# EAGLE design uCBoard (EAGLE 7.5.0)
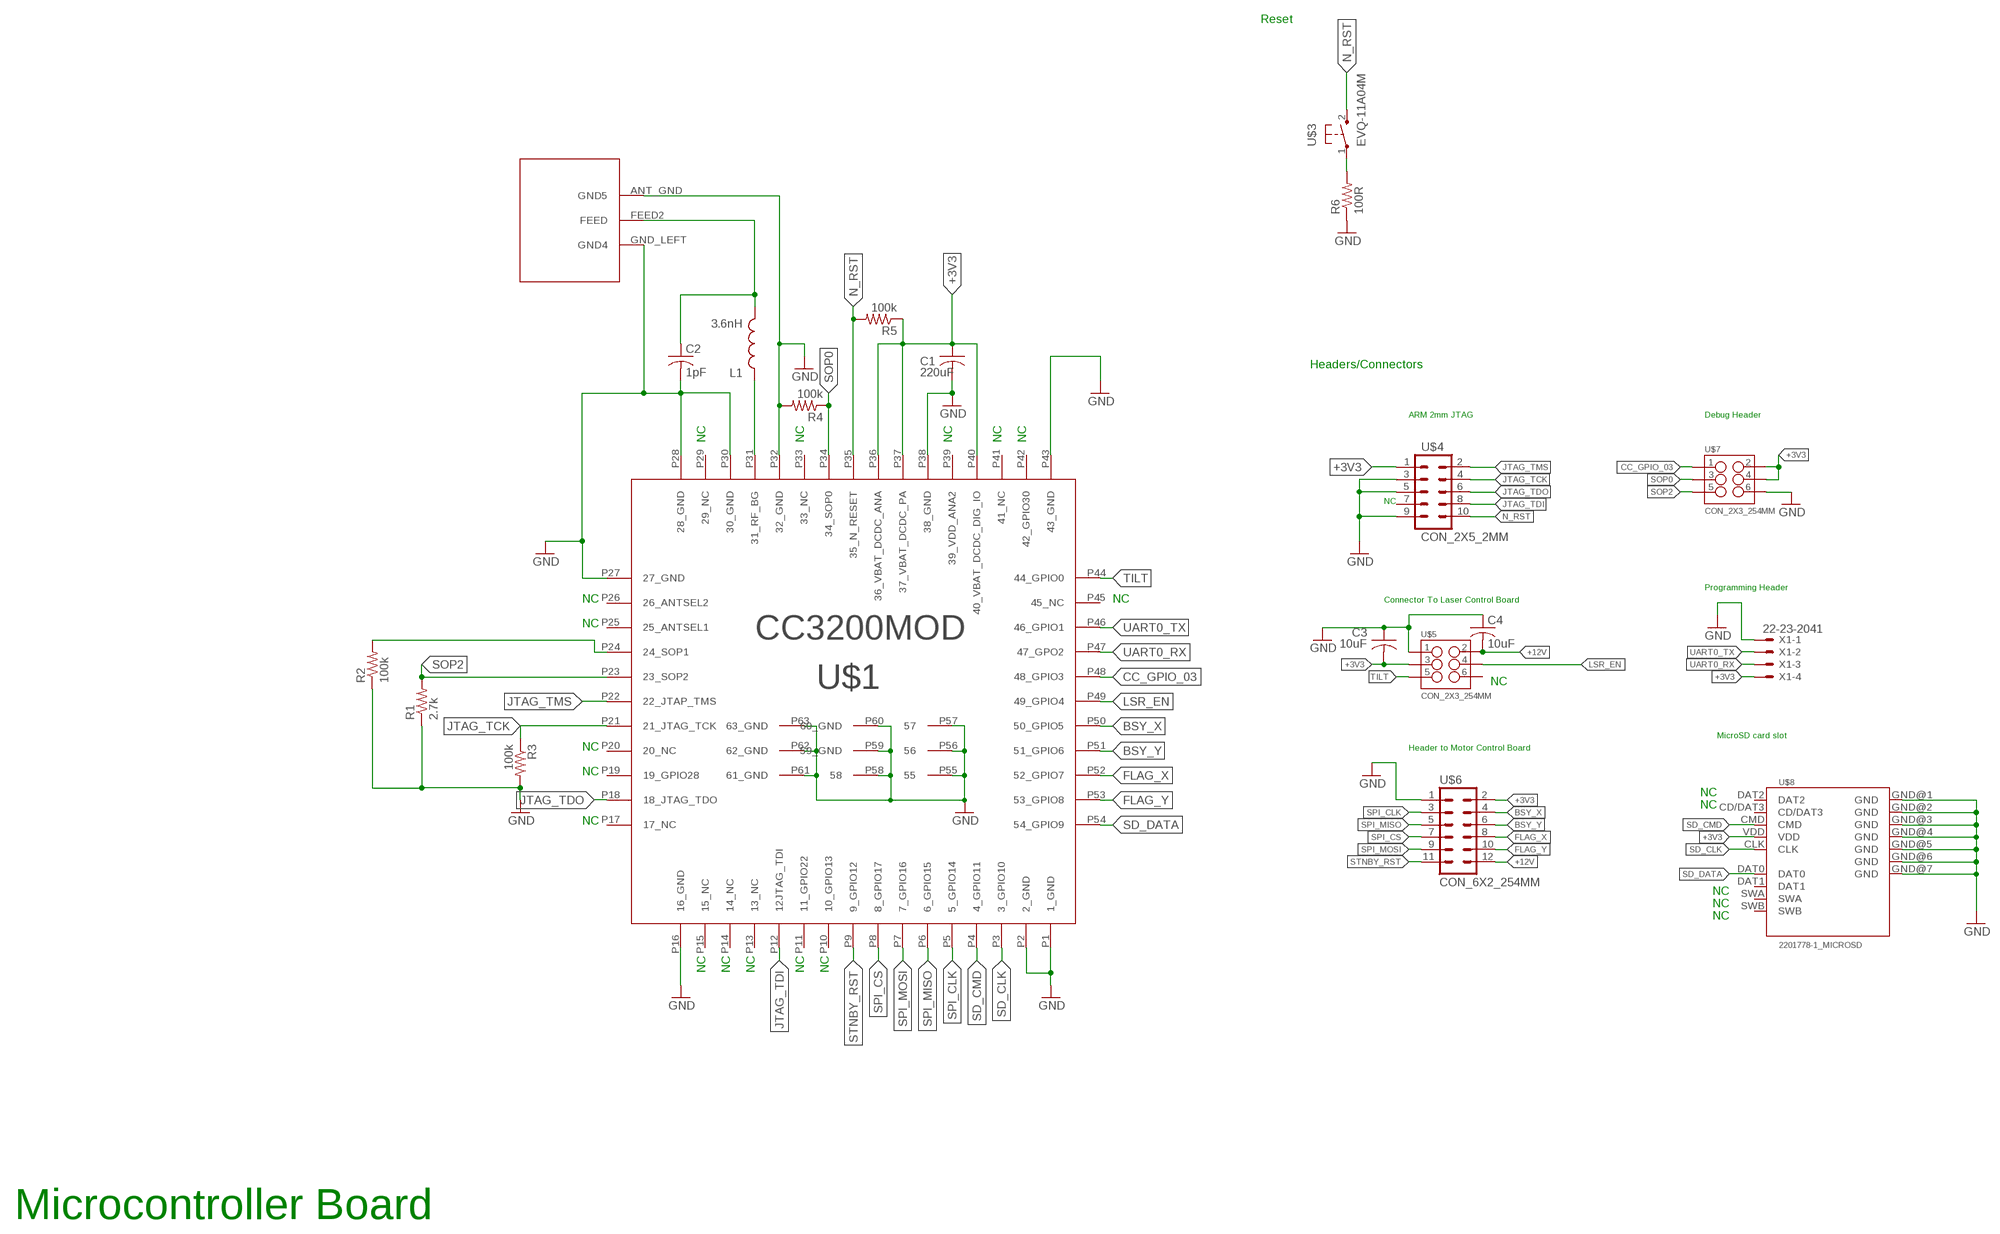
[diagram p0: schematic, sheet 1]

## Parts
C1  220uF  C-USC1210  [C1210]
C2  1pF  C-USC0805  [C0805]
C3  10uF  C-USC0805  [C0805]
C4  10uF  C-USC0805  [C0805]
L1  3.6nH  INDUCTOR0402  [C0402]
R1  2.7k  R-US_R0805  [R0805]
R2  100k  R-US_R0805  [R0805]
R3  100k  R-US_R0805  [R0805]
R4  100k  R-US_R0805  [R0805]
R5  100k  R-US_R0805  [R0805]
R6  100R  R-US_R0805  [R0805]
U$1  CC3200  [CC3200MOD]
U$2  ANT  [ANT]
U$3  EVQ-11A04M  [EVQ--11A04M]
U$4  CON_2X5_2MM  [CON_2X5_2MM]
U$5  CON_2X3_254MM  [CON_2X3_254MM]
U$6  CON_6X2_254MM  [CON_6X2_254MM]
U$7  CON_2X3_254MM  [CON_2X3_254MM]
U$8  2201778-1_MICROSD  [2201778-1]
X1  22-23-2041  [22-23-2041]

## Nets
+3V3: C1.1 C3.2 R5.1 U$1.P36(36_VBAT_DCDC_ANA) U$1.P37(37_VBAT_DCDC_PA) U$1.P40(40_VBAT_DCDC_DIG_IO) U$4.1 U$5.3 U$6.2 U$7.2 U$7.4 U$8.VDD X1.4
+12V: C4.2 U$5.2 U$6.12
BSY_X: U$1.P50(50_GPIO5) U$6.4
BSY_Y: U$1.P51(51_GPIO6) U$6.6
CC_GPIO_03: U$1.P48(48_GPIO3) U$7.1
FLAG_X: U$1.P52(52_GPIO7) U$6.8
FLAG_Y: U$1.P53(53_GPIO8) U$6.10
GND [Antenna]: C1.2 C2.2 C3.1 C4.1 R1.1 R2.1 R3.2 R4.2 R6.1 U$1.P1(1_GND) U$1.P2(2_GND) U$1.P16(16_GND) U$1.P27(27_GND) U$1.P28(28_GND) U$1.P30(30_GND) U$1.P32(32_GND) U$1.P38(38_GND) U$1.P43(43_GND) U$1.P55 U$1.P56 U$1.P57 U$1.P58 U$1.P59(59_GND) U$1.P60(60_GND) U$1.P61(61_GND) U$1.P62(62_GND) U$1.P63(63_GND) U$2.ANT_GND(GND5) U$2.GND_LEFT(GND4) U$4.3 U$4.5 U$4.9 U$5.1 U$6.1 U$7.6 U$8.GND@1(GND) U$8.GND@2(GND) U$8.GND@3(GND) U$8.GND@4(GND) U$8.GND@5(GND) U$8.GND@6(GND) U$8.GND@7(GND) X1.1
JTAG_TCK: R3.1 U$1.P21(21_JTAG_TCK) U$4.4
JTAG_TDI: U$1.P12(12JTAG_TDI) U$4.8
JTAG_TDO: U$1.P18(18_JTAG_TDO) U$4.6
JTAG_TMS: U$1.P22(22_JTAP_TMS) U$4.2
LSR_EN: U$1.P49(49_GPIO4) U$5.4
N$2: R6.2 U$3.1
N$3 [Antenna]: L1.1 U$1.P31(31_RF_BG)
N$4: R2.2 U$1.P24(24_SOP1)
N$5 [Antenna]: C2.1 L1.2 U$2.FEED2(FEED)
N_RST: R5.2 U$1.P35(35_N_RESET) U$3.2 U$4.10
SD_CLK: U$1.P3(3_GPIO10) U$8.CLK
SD_CMD: U$1.P4(4_GPIO11) U$8.CMD
SD_DATA: U$1.P54(54_GPIO9) U$8.DAT0
SOP0: R4.1 U$1.P34(34_SOP0) U$7.3
SOP2: R1.2 U$1.P23(23_SOP2) U$7.5
SPI_CLK: U$1.P5(5_GPIO14) U$6.3
SPI_CS: U$1.P8(8_GPIO17) U$6.7
SPI_MISO: U$1.P6(6_GPIO15) U$6.5
SPI_MOSI: U$1.P7(7_GPIO16) U$6.9
STNBY_RST: U$1.P9(9_GPIO12) U$6.11
TILT: U$1.P44(44_GPIO0) U$5.5
UART0_RX: U$1.P47(47_GPO2) X1.3
UART0_TX: U$1.P46(46_GPIO1) X1.2
Unconnected: U$1.P10(10_GPIO13) U$1.P11(11_GPIO22) U$1.P13(13_NC) U$1.P14(14_NC) U$1.P15(15_NC) U$1.P17(17_NC) U$1.P19(19_GPIO28) U$1.P20(20_NC) U$1.P25(25_ANTSEL1) U$1.P26(26_ANTSEL2) U$1.P29(29_NC) U$1.P33(33_NC) U$1.P39(39_VDD_ANA2) U$1.P41(41_NC) U$1.P42(42_GPIO30) U$1.P45(45_NC) U$4.7 U$5.6 U$8.CD/DAT3 U$8.DAT1 U$8.DAT2 U$8.SWA U$8.SWB

## Notes on the sheet
- Reset
- Headers/Connectors
- ARM 2mm JTAG | Debug Header
- NC | NC | NC | NC | NC
- NC
- Programming Header
- NC | NC | Connector To Laser Control Board
- NC
- NC
- MicroSD card slot
- NC | Header to Motor Control Board
- NC
- NC
- NC
- NC
- NC
- NC
- NC
- NC | NC | NC | NC | NC
- Microcontroller Board

## Library data of the parts
C1 = rcl:C-US: CAPACITOR, American symbol
C2-C4 = resistor:C-US: CAPACITOR, American symbol
L1 = SparkFun-Passives:INDUCTOR: Inductors Basic Inductor/Choke - 0603 and 1206. Footprints are not proven and vary greatly between part numbers. INDUCTOR POWER 3.3UH 4.0A SMD 0.197" L x 0.197" W x 0.177" H (5.00mm x 5.00mm x 4.50mm)
R1-R6 = resistor:R-US_: RESISTOR, American symbol
U$1 = cc3200mod:CC3200
U$2 = Antenna:ANT
U$3 = ChristiansCustom:EVQ-11A04M
U$4 = ChristiansCustom:CON_2X5_2MM
U$5 U$7 = ChristiansCustom:CON_2X3_254MM
U$6 = ChristiansCustom:CON_6X2_254MM
U$8 = ChristiansCustom:2201778-1_MICROSD
X1 = con-molex:22-23-2041: .100" (2.54mm) Center Header - 4 Pin; MF: MOLEX; MPN: 22-23-2041; OC_FARNELL: 1462920; OC_NEWARK: 38C0355

## Net classes
0 Default: clearance 0.254 mm
1 Antenna: clearance 0.127 mm

## Board
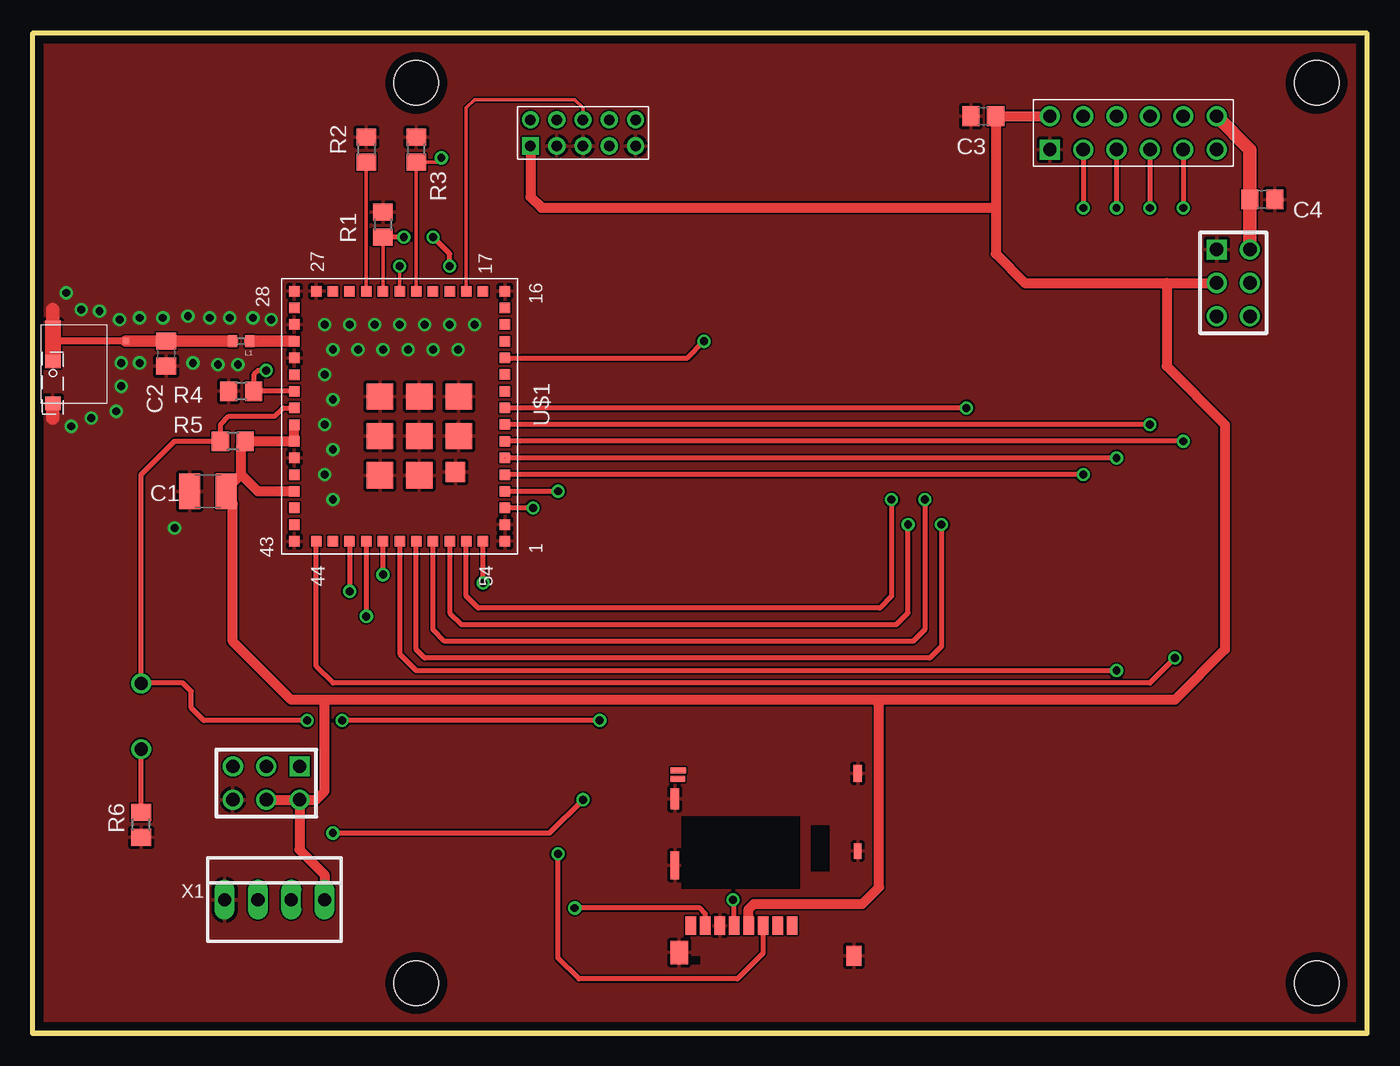
[diagram p1: board, top side]
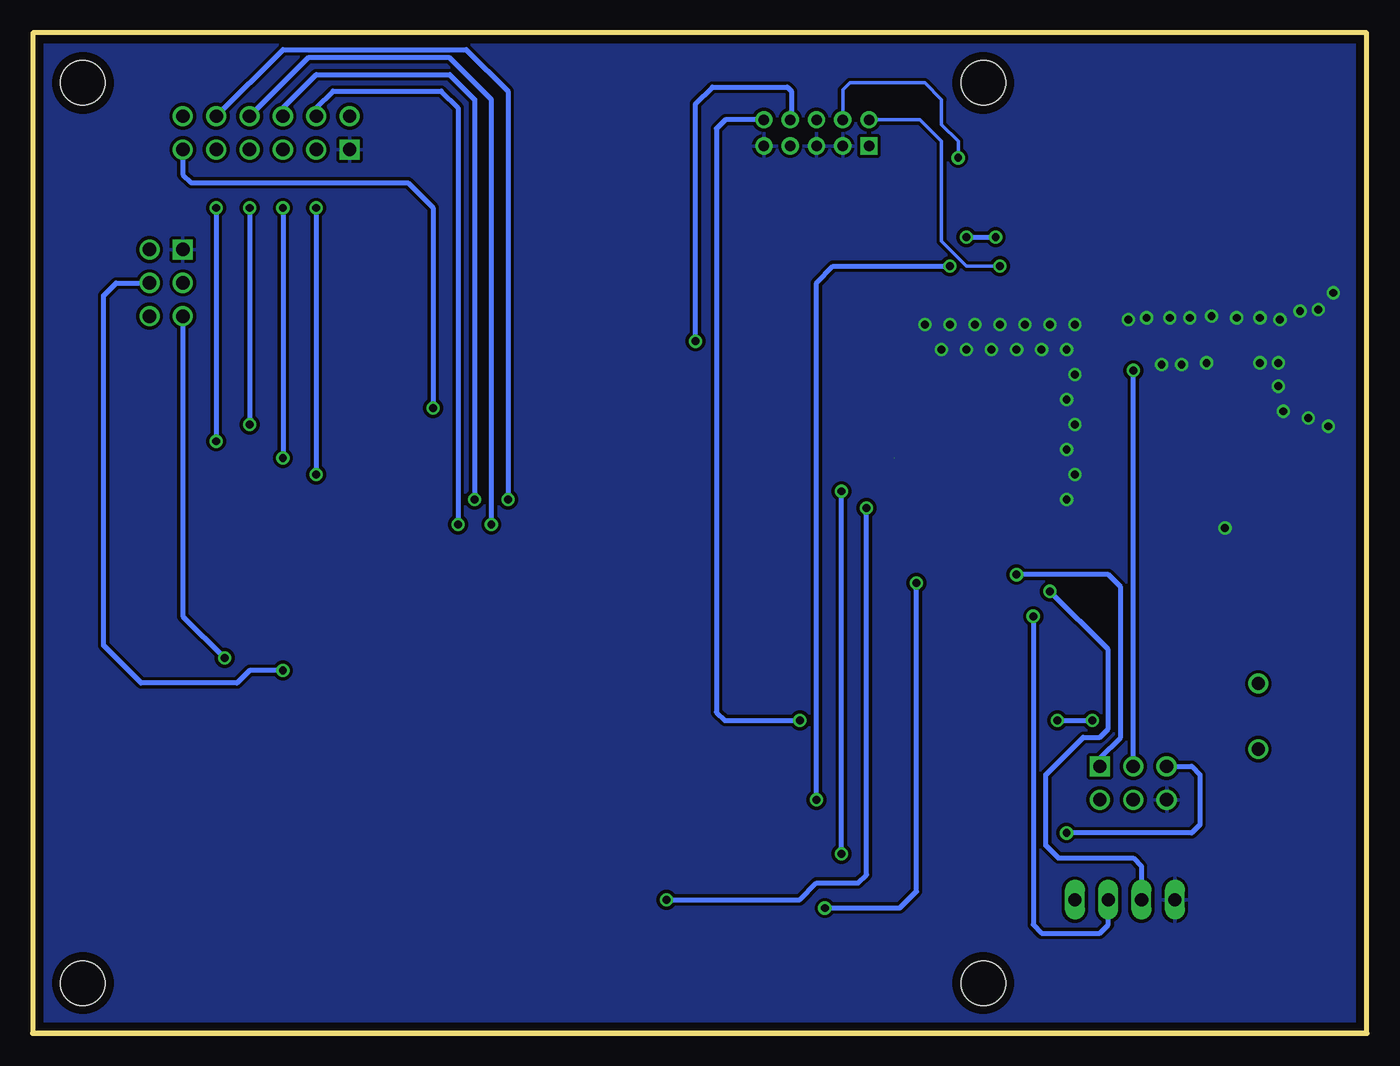
[diagram p2: board, bottom side, seen from below]

Size 101.6 x 76.2 mm. Coordinates in mm from the lower left corner, seen from the top.
Outline: 101.6,0 0,0 0,76.2 101.6,76.2 101.6,0
Copper layers (1*16): Top 0.035mm / dielectric 1.5mm / Bottom 0.035mm
Design rules "default *": minimum track width 10mil, minimum drill 10mil, track to track 5mil, track to pad 10mil, pad to pad 10mil, via to via 10mil, smd to smd 10mil, copper to edge 25mil, drill to drill 8mil, minimum pad ring 10mil, minimum via ring 8mil, stop-mask expansion 4mil, vias tented up to drill 0mil, thermal gap 10mil
Holes 3.4 mm at 29.21,3.81 29.21,72.39 97.79,72.39 97.79,3.81

### Footprints (pad centres in the part's own frame; a part is rotated, then mirrored left to right if it is on the bottom)
C1210 = smd 1.6 x 2.7: 1 -1.4,0; 2 1.4,0
C0805 = smd 1.3 x 1.5: 1 -0.95,0; 2 0.95,0
C0402 = smd 0.7 x 0.9: 1 -0.65,0; 2 0.65,0
R0805 = smd 1.3 x 1.5: 1 -0.95,0; 2 0.95,0
CC3200MOD = smd 0.8 x 0.8: P1 9.52,8.025; P2 8.25,8.025; P3 6.98,8.025; P4 5.71,8.025; P5 4.44,8.025; P6 3.17,8.025; P7 1.9,8.025; P8 0.63,8.025; P9 -0.64,8.025; P10 -1.91,8.025; P11 -3.18,8.025; P12 -4.45,8.025; P13 -5.72,8.025; P14 -6.99,8.025; P15 -8.26,8.025; P16 -9.53,8.025; P17 -9.525,6.35; P18 -9.525,5.08; P19 -9.525,3.81; P20 -9.525,2.54; P21 -9.525,1.27; P22 -9.525,0; P23 -9.525,-1.27; P24 -9.525,-2.54; P25 -9.525,-3.81; P26 -9.525,-5.08; P27 -9.525,-6.35; P28 -9.525,-8.02; P29 -8.255,-8.02; P30 -6.985,-8.02; P31 -5.715,-8.02; P32 -4.445,-8.02; P33 -3.175,-8.02; P34 -1.905,-8.02; P35 -0.635,-8.02; P36 0.635,-8.02; P37 1.905,-8.02; P38 3.175,-8.02; P39 4.445,-8.02; P40 5.715,-8.02; P41 6.985,-8.02; P42 8.255,-8.02; P43 9.525,-8.02; P44 9.525,-6.35; P45 9.525,-5.08; P46 9.525,-3.81; P47 9.525,-2.54; P48 9.525,-1.27; P49 9.525,0; P50 9.525,1.27; P51 9.525,2.54; P52 9.525,3.81; P53 9.525,5.08; P54 9.525,6.35 | smd 1.5 x 1.5: P55 4.25,4.25 | smd 2 x 2: P56 1.5,-1.5; P57 -1.5,4.5; P58 4.5,1.5; P59 1.5,1.5; P60 -1.5,1.5; P61 4.5,-1.5; P62 1.5,4.5; P63 -1.5,-1.5
ANT = smd 1 x 1.2: ANT_FEED 2.8,0.9; ANT_GND 6,0.9 | smd 0.5 x 0.5: FEED2 1.25,6.45 | smd 0.3 x 1.2: GND_LEFT -0.15,0.9
EVQ--11A04M = drill 1: 1 -2.5,0; 2 2.5,0
CON_2X5_2MM = drill 0.8 square: 1 -4,-1 | drill 0.8: 2 -4,1; 3 -2,-1; 4 -2,1; 5 0,-1; 6 0,1; 7 2,-1; 8 2,1; 9 4,-1; 10 4,1
CON_2X3_254MM = drill 1.02 square: 1 -2.54,-1.27 | drill 1.02: 2 -2.54,1.27; 3 0,-1.27; 4 0,1.27; 5 2.54,-1.27; 6 2.54,1.27
CON_6X2_254MM = drill 1.02 square: 1 -6.35,-1.27 | drill 1.02: 2 -6.35,1.27; 3 -3.81,-1.27; 4 -3.81,1.27; 5 -1.27,-1.27; 6 -1.27,1.27; 7 1.27,-1.27; 8 1.27,1.27; 9 3.81,-1.27; 10 3.81,1.27; 11 6.35,-1.27; 12 6.35,1.27
2201778-1 = smd 0.8 x 1.4: CD/DAT3 2.75,-0.7; CLK -0.55,-0.7; CMD 1.65,-0.7; DAT0 -2.75,-0.7; DAT1 -3.85,-0.7; DAT2 3.85,-0.7; GND@1 -1.65,-0.7; VDD 0.55,-0.7 | smd 1.35 x 1.8: GND@2 -4.74,-2.75 | smd 0.65 x 2.14: GND@3 -5.065,3.88 | smd 0.65 x 1.6: GND@4 -5.065,8.96 | smd 0.65 x 1.3: GND@5 8.86,10.9 | smd 0.6 x 1.15: GND@6 8.86,4.975 | smd 1.16 x 1.5: GND@7 8.56,-3 | smd 1.15 x 0.45: SWA -4.815,11.125 | smd 1.1 x 0.45: SWB -4.84,10.465
22-23-2041 = drill 1 long: 1 -3.81,0; 2 -1.27,0; 3 1.27,0; 4 3.81,0

### Placement (x,y rotation side)
C1  13.34,41.27 180 top
C2  10.16,51.75 270 top
C3  72.39,69.85 0 top
C4  93.66,63.5 180 top
L1  15.88,52.7 180 top
R1  26.67,61.59 270 top
R2  25.4,67.31 270 top
R3  29.21,67.31 90 top
R4  15.88,48.9 180 top
R5  15.24,45.09 180 top
R6  8.26,15.88 90 top
U$1  27.94,46.99 270 top
U$2  0.64,53.98 270 top
U$3  8.26,24.13 90 top
U$4  41.91,68.58 0 top
U$5  91.44,57.15 270 top
U$6  83.82,68.58 0 top
U$7  17.78,19.05 180 top
U$8  53.98,8.89 0 top
X1  18.41,10.16 0 top

### Tracks (layer width: path | path; a pad name or v marks a point on that pad's centre or on a via)
+3V3
  Top 0.762: U$6.2 C3.2 73.34,62.87 | 73.34,62.87 73.34,59.38 75.56,57.15 86.36,57.15 | 86.36,57.15 U$5.3 | U$4.1 37.91,63.69 38.73,62.87 73.34,62.87 | 15.88,42.55 14.61,41.27 C1.1 15.24,40.32 15.24,29.84 19.68,25.4 22.23,25.4 | 15.88,42.55 15.88,44.77 R5.1 U$1.P37 U$1.P36 | U$1.P40 17.14,41.27 15.88,42.55 | 86.36,57.15 86.36,50.8 90.81,46.35 90.81,29.21 87,25.4 64.14,25.4 | 64.14,25.4 22.23,25.4 | U$7.2 21.59,17.78 22.23,18.41 22.23,25.4 | U$7.2 20.32,13.97 22.23,12.06 X1.4 | U$8.VDD 54.52,9.44 54.93,9.84 63.18,9.84 64.45,11.11 64.45,25.08 64.14,25.4 | U$7.4 U$7.2
+12V
  Top 1.016: U$5.2 C4.2 92.71,67.31 U$6.12
BSY_X  (via drill 0.6)
  Top 0.381: v69.22,38.73 69.22,29.47 68.32,28.57 29.84,28.57 29.21,29.21 U$1.P50
  Bottom 0.381: U$6.4 80.01,70.48 78.74,71.75 70.48,71.75 69.22,70.48 v69.22,38.73
BSY_Y  (via drill 0.6)
  Top 0.381: v67.94,40.64 67.94,30.74 67.05,29.84 31.38,29.84 30.48,30.74 U$1.P51
  Bottom 0.381: U$6.6 82.55,70.48 80.01,73.03 69.85,73.03 67.94,71.12 v67.94,40.64
CC_GPIO_03  (via drill 0.6)
  Top 0.381: v26.67,34.92 U$1.P48
  Bottom 0.381: U$7.1 20.32,20.95 18.73,22.54 18.73,33.97 19.68,34.92 v26.67,34.92
FLAG_X  (via drill 0.6)
  Top 0.381: U$1.P52 31.75,32.01 32.65,31.11 65.78,31.11 66.67,32.01 v66.67,38.73
  Bottom 0.381: v66.67,38.73 66.67,71.12 69.85,74.3 80.64,74.3 U$6.8
FLAG_Y  (via drill 0.6)
  Top 0.381: v65.41,40.64 65.41,33.28 64.51,32.38 33.92,32.38 33.02,33.28 U$1.P53
  Bottom 0.381: U$6.10 82.55,74.93 68.58,74.93 65.41,71.75 v65.41,40.64
GND  (via drill 0.6)
  Top 1.016: U$2.GND_LEFT 1.52,54.12 1.52,55.12 | U$2.ANT_GND 1.52,47.98 1.52,46.86
  other vias: 2.92,46.23 4.45,46.86 6.35,47.37 6.73,49.28 6.73,51.05 22.86,40.64 30.48,52.07 28.57,52.07 26.67,52.07 15.62,50.93 14.1,50.93 12.19,51.05 18.16,54.36 16.76,54.48 14.99,54.48 13.46,54.48 9.91,54.48 8.13,51.05 8.13,54.48 6.6,54.36 5.08,54.99 3.68,55.12 2.54,56.39 11.81,54.61 24.77,52.07 22.86,52.07 22.23,50.16 22.86,48.26 22.23,46.35 22.86,44.45 22.23,42.55 22.23,53.98 24.13,53.98 26.04,53.98 27.94,53.98 29.84,53.98 31.75,53.98 32.38,52.07 33.66,53.98 10.79,38.48
  pour Top: 0,0 101.6,0 101.6,76.2 0,76.2
  pour Bottom (isolate 0.254): 0,0 101.6,0 101.6,76.2 0,76.2
JTAG_TCK  (via drill 0.6)
  Top 0.254: U$1.P21 R3.1 30.8,66.36 v31.11,66.67
  Bottom 0.254: U$4.4 39.91,71.85 39.37,72.39 33.66,72.39 32.38,71.12 32.38,69.22 31.11,67.94 v31.11,66.67
JTAG_TDI  (via drill 0.6)
  Top 0.381: U$1.P12 49.85,51.44 v51.12,52.7
  Bottom 0.381: v51.12,52.7 51.12,70.8 49.85,72.07 44.13,72.07 43.81,71.75 43.81,69.67 U$4.8
JTAG_TDO
  Top 0.254: U$1.P18 33.02,70.48 33.66,71.12 41.27,71.12 41.91,70.48 U$4.6
JTAG_TMS  (via drill 0.6)
  Top 0.254: v27.94,58.42 U$1.P22
  Bottom 0.254: U$4.2 34.02,69.58 32.38,67.94 32.38,60.33 30.48,58.42 v27.94,58.42
LSR_EN  (via drill 0.6)
  Top 0.381: U$1.P49 27.94,28.89 29.21,27.62 v82.55,27.62
  Bottom 0.381: v82.55,27.62 85.09,27.62 86.04,26.67 93.34,26.67 96.2,29.53 96.2,56.2 95.25,57.15 U$5.4
N$2
  Top 0.381: R6.2 U$3.1
N$3
  Top 0.864: L1.1 U$1.P31
N$4
  Top 0.254: U$1.P24 R2.2
N$5
  Top 0.762: 10.14,52.73 C2.1 | L1.2
  Top 0.864: U$2.FEED2 10.14,52.73 | C2.1 L1.2
N_RST  (via drill 0.6)
  Top 0.381: U$1.P35 19.05,47.62 18.41,46.99 14.92,46.99 14.29,46.36 R5.2 10.79,45.09 8.26,42.55 U$3.2 8.29,26.67 11.43,26.67 12.06,26.04 12.06,24.77 13.02,23.81 v20.89,23.81 | v43.18,23.81 v23.56,23.81
  Bottom 0.381: U$4.10 48.85,69.58 49.53,68.9 49.53,24.45 48.9,23.81 v43.18,23.81 | v23.56,23.81 v20.89,23.81
SD_CLK  (via drill 0.6)
  Top 0.381: U$8.CLK 53.42,10.07 v53.34,10.16 | v38.1,40.01 U$1.P3
  Bottom 0.381: v53.34,10.16 43.18,10.16 41.91,11.43 38.73,11.43 38.1,12.06 v38.1,40.01
SD_CMD  (via drill 0.6)
  Top 0.381: U$8.CMD 55.62,6.09 53.66,4.13 41.59,4.13 40.01,5.71 v40.01,13.65 | v40.01,41.27 U$1.P4
  Bottom 0.381: v40.01,13.65 v40.01,41.27
SD_DATA  (via drill 0.6)
  Top 0.381: U$8.DAT0 51.23,9.1 50.8,9.53 v41.27,9.53 | v34.29,34.29 U$1.P54
  Bottom 0.381: v41.27,9.53 35.56,9.53 34.29,10.79 v34.29,34.29
SOP0  (via drill 0.6)
  Top 0.381: U$1.P34 R4.1 16.83,50.16 17.14,50.48 v17.78,50.48
  Bottom 0.381: U$7.3 v17.78,50.48
SOP2  (via drill 0.6)
  Top 0.254: U$1.P23 R1.2
  Top 0.381: v22.86,15.24 39.37,15.24 v41.91,17.78 | v31.75,58.42 31.75,59.37 v30.48,60.64 | v28.26,60.64 R1.2
  Bottom 0.381: U$7.5 13.34,20.32 12.7,19.68 12.7,15.88 13.34,15.24 v22.86,15.24 | v41.91,17.78 41.91,57.15 40.64,58.42 v31.75,58.42 | v30.48,60.64 v28.26,60.64
SPI_CLK  (via drill 0.6)
  Top 0.381: U$6.3 v80.01,62.87 | v80.01,42.55 U$1.P5
  Bottom 0.381: v80.01,62.87 v80.01,42.55
SPI_CS  (via drill 0.6)
  Top 0.381: U$6.7 v85.09,62.87 | v85.09,46.35 U$1.P8
  Bottom 0.381: v85.09,62.87 v85.09,46.35
SPI_MISO  (via drill 0.6)  (1 unrouted)
  Top 0.381: U$6.5 v82.55,62.87 | v82.55,43.81 U$1.P6
  Bottom 0.381: v82.55,62.87 v82.55,43.81
SPI_MOSI  (via drill 0.6)
  Top 0.381: U$6.9 v87.63,62.87 | v87.63,45.09 U$1.P7
  Bottom 0.381: v87.63,62.87 v87.63,45.09
STNBY_RST  (via drill 0.6)
  Top 0.381: v71.12,47.62 U$1.P9
  Bottom 0.381: U$6.11 90.17,65.41 89.53,64.77 73.03,64.77 71.12,62.87 v71.12,47.62
TILT  (via drill 0.6)
  Top 0.381: v87,28.57 85.09,26.67 22.86,26.67 21.59,27.94 U$1.P44
  Bottom 0.381: U$5.5 90.17,31.75 v87,28.57
UART0_RX  (via drill 0.6)
  Top 0.381: U$1.P47 v25.4,31.75
  Bottom 0.381: v25.4,31.75 25.4,8.26 24.77,7.62 20.32,7.62 19.68,8.26 X1.3
UART0_TX  (via drill 0.6)
  Top 0.381: U$1.P46 v24.13,33.66
  Bottom 0.381: X1.2 17.14,12.7 17.78,13.34 23.5,13.34 24.45,14.29 24.45,19.68 21.59,22.54 20.32,22.54 19.68,23.18 19.68,29.21 v24.13,33.66